# EAGLE design stereo-amp-rev1 (EAGLE 7.2.0)
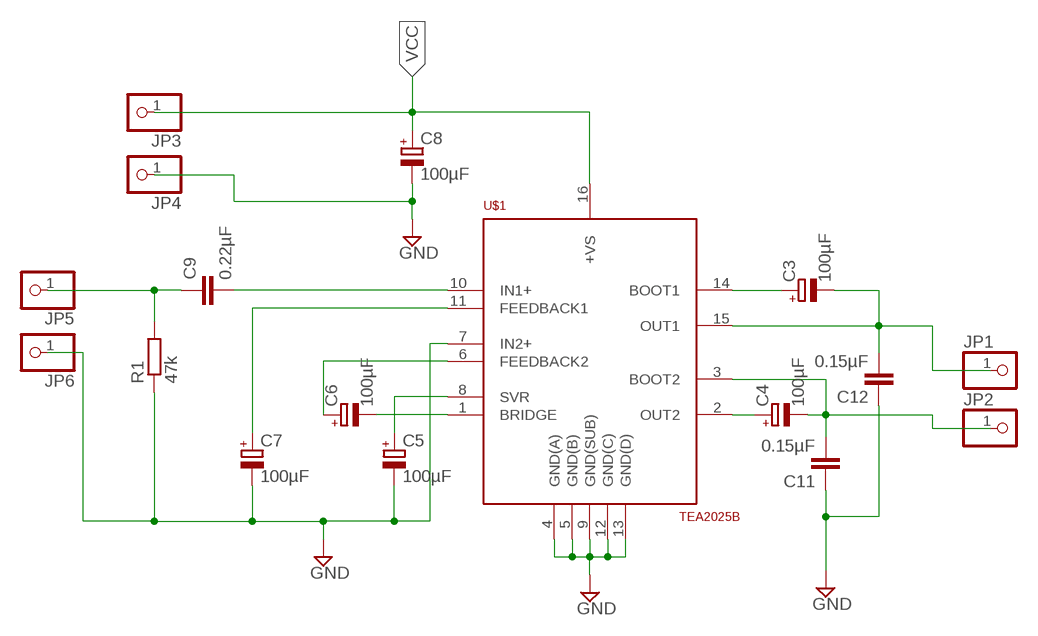
[diagram p0: schematic, sheet 1]

## Parts
C3  100µF  CPOL-EUE2.5-7  [E2,5-7]
C4  100µF  CPOL-EUE2.5-7  [E2,5-7]
C5  100µF  CPOL-EUE2.5-7  [E2,5-7]
C6  100µF  CPOL-EUE2.5-7  [E2,5-7]
C7  100µF  CPOL-EUE2.5-7  [E2,5-7]
C8  100µF  CPOL-EUE2.5-7  [E2,5-7]
C9  0.22µF  C-EU050-024X044  [C050-024X044]
C11  0.15µF  C-EU050-024X044  [C050-024X044]
C12  0.15µF  C-EU050-024X044  [C050-024X044]
JP1  PINHD-1X1  [1X01]
JP2  PINHD-1X1  [1X01]
JP3  PINHD-1X1  [1X01]
JP4  PINHD-1X1  [1X01]
JP5  PINHD-1X1  [1X01]
JP6  PINHD-1X1  [1X01]
R1  47k  R-EU_0207/10  [0207/10]
U$1  TEA2025B  [DIL16]

## Nets
GND: C5.- C7.- C8.- C11.1 C12.1 JP4.1 JP6.1 R1.1 U$1.4(GND(A)) U$1.5(GND(B)) U$1.7(IN2+) U$1.9(GND(SUB)) U$1.12(GND(C)) U$1.13(GND(D))
N$1: C9.2 U$1.10(IN1+)
N$2: C6.- U$1.1(BRIDGE)
N$3: C7.+ U$1.11(FEEDBACK1)
N$4: C6.+ U$1.6(FEEDBACK2)
N$5: C5.+ U$1.8(SVR)
N$6: C4.+ U$1.2(OUT2)
N$7: C4.- C11.2 JP2.1 U$1.3(BOOT2)
N$8: C3.+ U$1.14(BOOT1)
N$9: C3.- C12.2 JP1.1 U$1.15(OUT1)
N$11: C9.1 JP5.1 R1.2
VCC: C8.+ JP3.1 U$1.16(+VS)

## Library data of the parts
C3-C8 = rcl:CPOL-EU: POLARIZED CAPACITOR, European symbol
C9 C11 C12 = rcl:C-EU: CAPACITOR, European symbol
JP1-JP6 = pinhead:PINHD-1X1: PIN HEADER
R1 = rcl:R-EU_: RESISTOR, European symbol
U$1 = build-electronic-circuits:TEA2025B

## Board
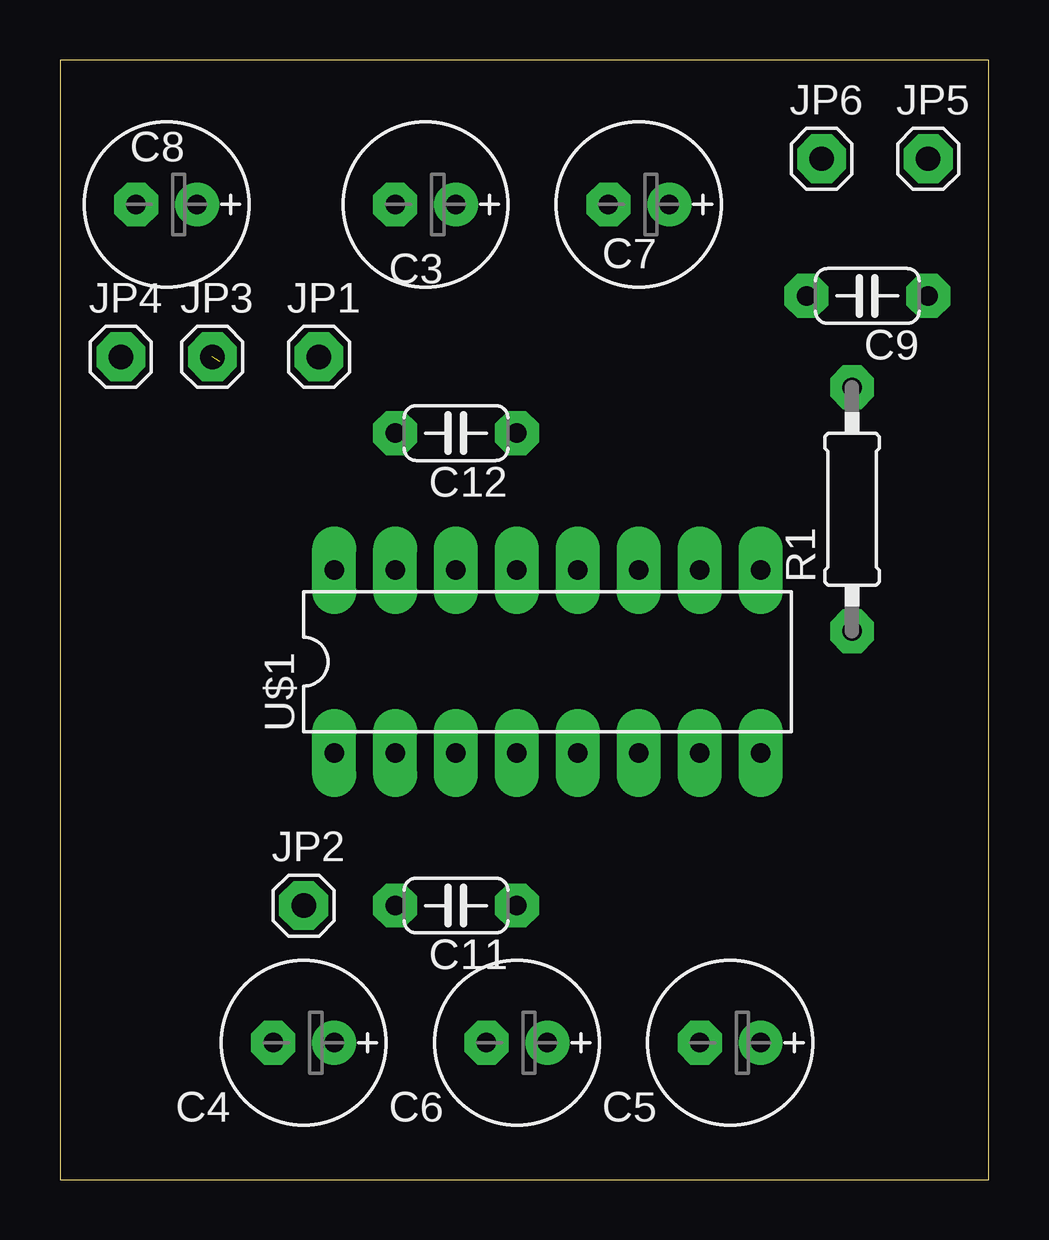
[diagram p1: board, top side]
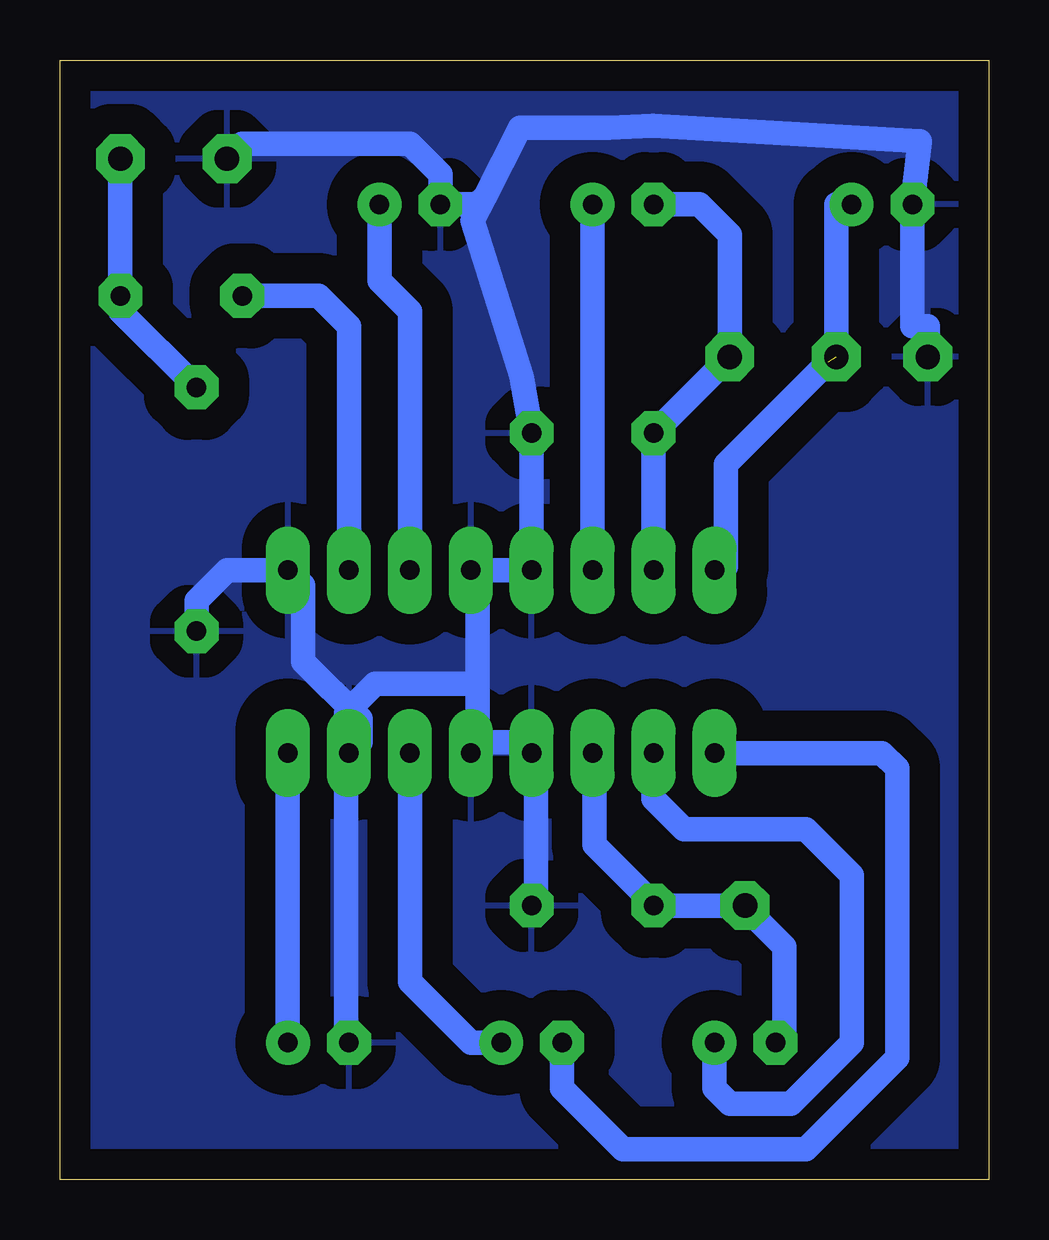
[diagram p2: board, bottom side, seen from below]

Size 38.72 x 46.66 mm. Coordinates in mm from the lower left corner, seen from the top.
Outline: 0,0 38.72,0 38.72,46.66 0,46.66 0,0
Copper layers (1*16): Top 0.035mm / dielectric 1.5mm / Bottom 0.035mm
Design rules "default": minimum track width 40mil, minimum drill 40mil, track to track 8mil, track to pad 8mil, pad to pad 8mil, via to via 8mil, smd to smd 8mil, copper to edge 40mil, drill to drill 8mil, minimum pad ring 20mil, minimum via ring 20mil, stop-mask expansion 4mil, vias tented up to drill 0mil, thermal gap 40mil

### Footprints (pad centres in the part's own frame; a part is rotated, then mirrored left to right if it is on the bottom)
E2,5-7 = drill 0.813 pad 1.6: + -1.27,0 | drill 0.813 pad 1.6 octagon: - 1.27,0
C050-024X044 = drill 0.813 octagon: 1 -2.54,0; 2 2.54,0
1X01 = drill 1.016 octagon: 1 0,0
0207/10 = drill 0.813 octagon: 1 -5.08,0; 2 5.08,0
DIL16 = drill 0.813 long: 1 -8.89,-3.81; 2 -6.35,-3.81; 3 -3.81,-3.81; 4 -1.27,-3.81; 5 1.27,-3.81; 6 3.81,-3.81; 7 6.35,-3.81; 8 8.89,-3.81; 9 8.89,3.81; 10 6.35,3.81; 11 3.81,3.81; 12 1.27,3.81; 13 -1.27,3.81; 14 -3.81,3.81; 15 -6.35,3.81; 16 -8.89,3.81

### Placement (x,y rotation side)
C3  15.24,40.64 180 top
C4  10.16,5.71 180 top
C5  27.94,5.71 180 top
C6  19.05,5.71 180 top
C7  24.13,40.64 180 top
C8  4.45,40.64 180 top
C9  33.66,36.83 180 top
C11  16.51,11.43 180 top
C12  16.51,31.11 180 top
JP1  10.8,34.29 0 top
JP2  10.16,11.43 0 top
JP3  6.35,34.29 0 top
JP4  2.54,34.29 0 top
JP5  36.2,42.55 0 top
JP6  31.75,42.55 0 top
R1  33.02,27.94 90 top
U$1  20.32,21.59 0 top

### Tracks (layer width: path | path; a pad name or v marks a point on that pad's centre or on a via)
GND
  Bottom 1.016: C5.- 26.8,6.04 26.8,17.63 U$1.7 | U$1.7 26.19,18.24 26.19,19.2 28.58,21.59 28.58,24.76 U$1.9 31.75,25.4 33.02,24.13 R1.1 | C11.1 18.87,11.53 18.87,17.63 U$1.4 19.48,18.24 21.31,18.24 | 21.31,25.55 U$1.12 | 21.31,20.68 21.31,24.94 U$1.12 | 21.31,20.68 21.31,18.24 | 21.31,18.24 U$1.5 | 20.99,40.97 21.51,39.95 19.48,33.48 C12.1 U$1.13 U$1.12 | 20.99,40.97 19.53,43.84 15.82,43.84 14,43.92 2.87,43.28 C8.- 3.18,35.56 2.54,35.56 JP4.1 | 21.31,20.68 25.58,20.68 26.8,19.46 U$1.7 | 20.99,40.97 21.33,40.64 C7.- 22.86,41.91 24.13,43.18 31.12,43.18 JP6.1
  pour Bottom (isolate 1.27): 0,46.36 0,0 38.73,0 38.73,46.36
N$1
  Bottom 1.016: C9.2 27.94,36.83 26.67,35.56 U$1.10
N$2
  Bottom 1.016: U$1.1 4.45,17.78 3.81,17.14 3.81,5.08 7.62,1.27 15.24,1.27 17.78,3.81 C6.-
N$3
  Bottom 1.016: U$1.11 24.13,36.19 25.4,37.47 C7.+
N$4
  Bottom 1.016: U$1.6 24.13,8.25 21.59,5.71 C6.+
N$5
  Bottom 1.016: C5.+ 29.23,6.04 29.23,17.63 U$1.8
N$6
  Bottom 1.016: U$1.2 13.97,15.87 12.7,14.6 7.62,14.6 5.71,12.7 5.71,5.71 8.25,3.17 10.8,3.17 11.43,3.81 C4.+
N$7
  Bottom 1.016: C4.- 8.51,6.04 8.51,9.7 10.16,11.35 JP2.1 C11.2 14,11.53 16.43,13.97 16.43,17.63 U$1.3
N$8
  Bottom 1.016: U$1.14 C3.+
N$9
  Bottom 1.016: U$1.15 C12.2 JP1.1 10.8,39.37 12.07,40.64 C3.-
N$11
  Bottom 1.016: JP5.1 C9.1 36.2,36.19 R1.2
VCC  (1 unrouted)
  Bottom 1.016: 6.68,34.09 10.95,29.82 10.95,25.55 U$1.16 | C8.+ 6.35,40.64 JP3.1